# EAGLE design Bordnetzwandler (EAGLE 6.6.0)

## Sheet 1 of 4: Supply
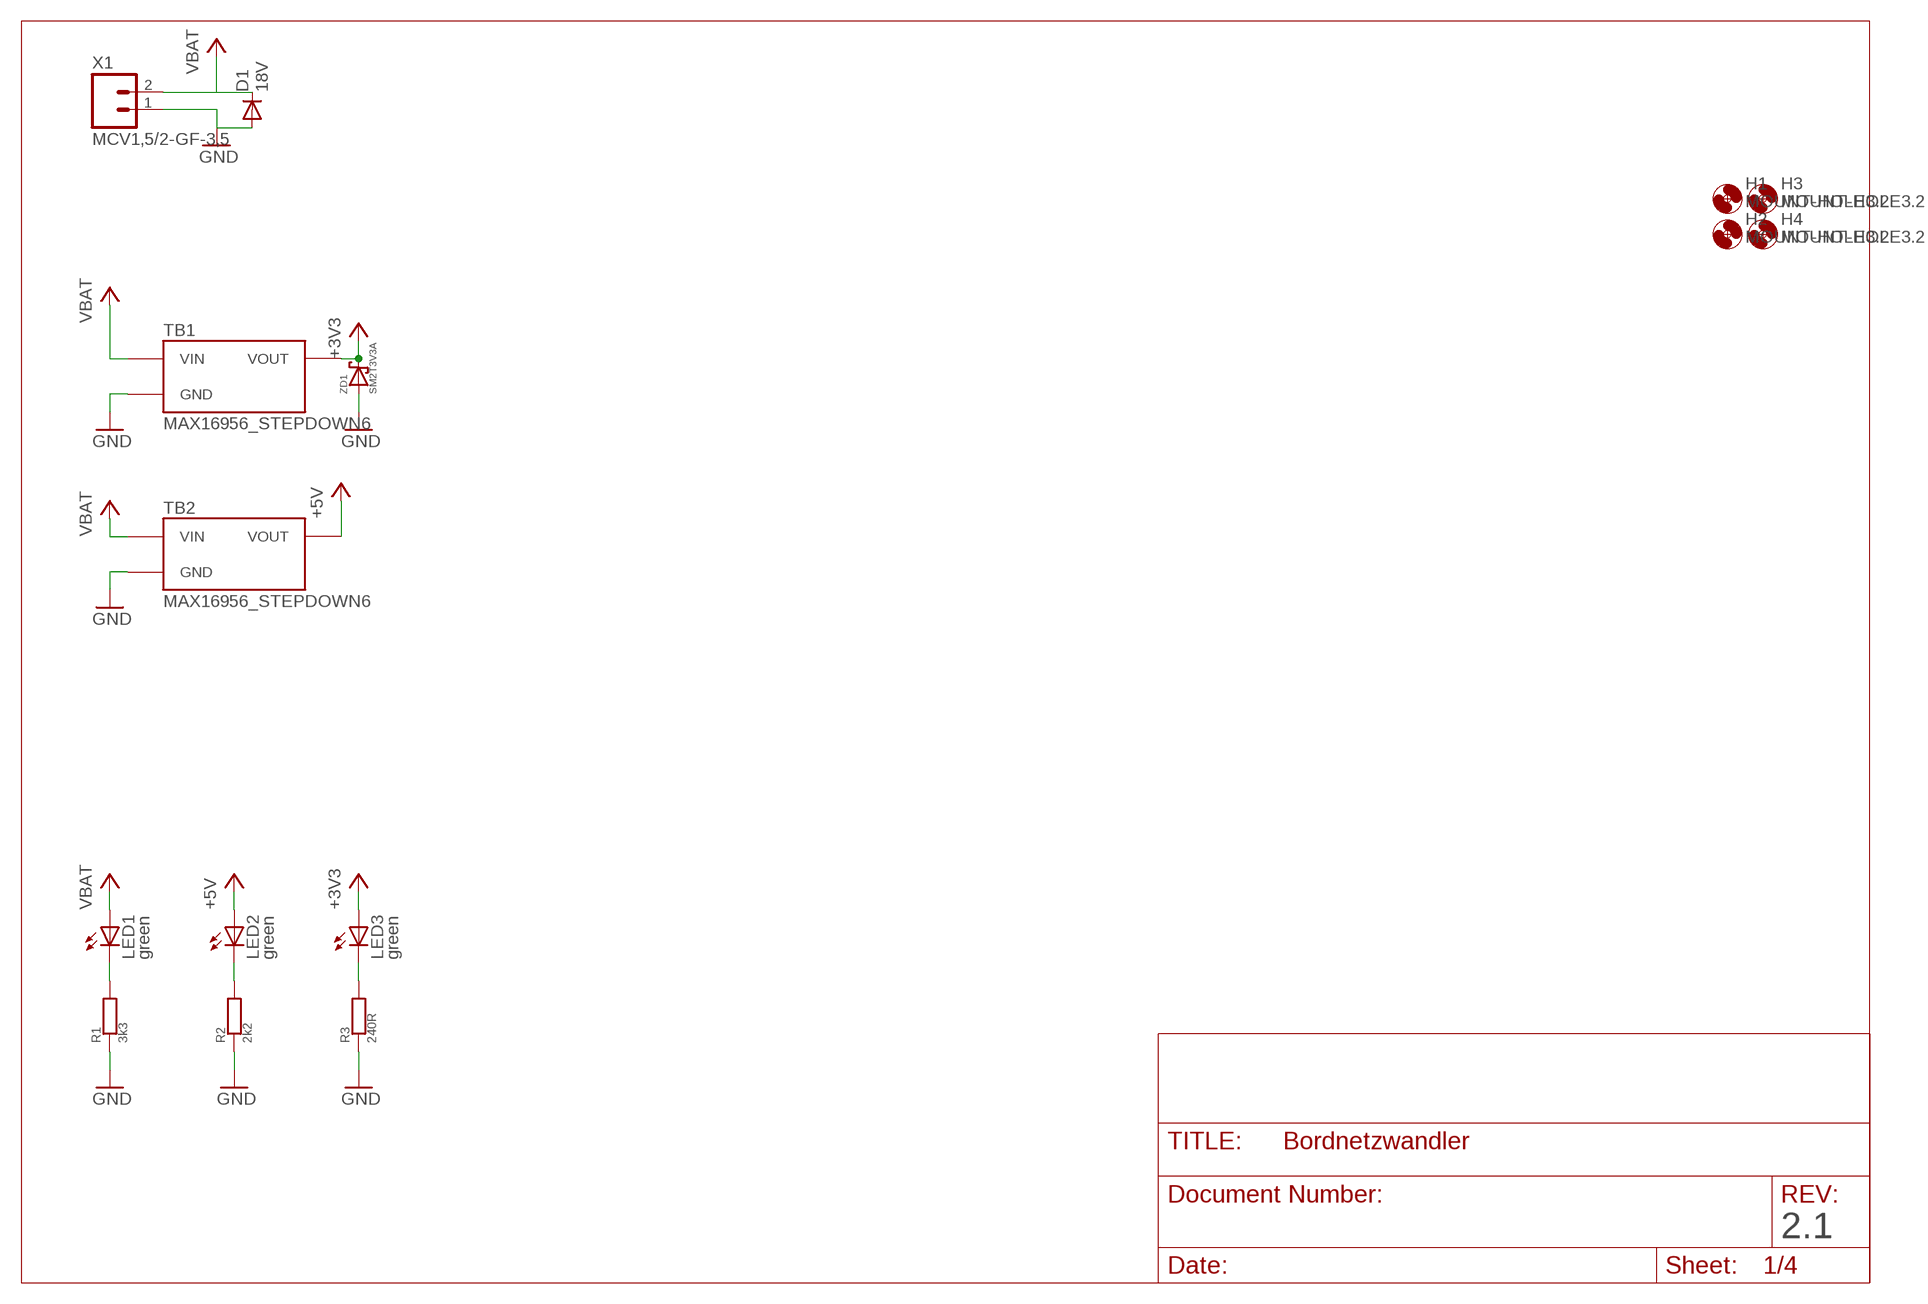
[diagram p0: schematic, sheet 1]

### Parts
D1  18V  DIODE-DO214AA  [DO214AA]
H1  MOUNT-HOLE3.2  [3,2]
H2  MOUNT-HOLE3.2  [3,2]
H3  MOUNT-HOLE3.2  [3,2]
H4  MOUNT-HOLE3.2  [3,2]
LED1  green  LEDCHIP-LED0805  [CHIP-LED0805]
LED2  green  LEDCHIP-LED0805  [CHIP-LED0805]
LED3  green  LEDCHIP-LED0805  [CHIP-LED0805]
R1  3k3  R  [R0805]
R2  2k2  R  [R0805]
R3  240R  R  [R0805]
TB1  MAX16956_STEPDOWN6  [MAX16956_STEPDOWN6]
TB2  MAX16956_STEPDOWN6  [MAX16956_STEPDOWN6]
X1  MCV1,5/2-GF-3,5  [MCV1,5/2-GF-3,5]
ZD1  SM2T3V3A  [SM2T3V3A]

### Nets
+3V3: LED3.A TB1.VOUT ZD1.P$2 ; also sheet 2,4
+5V: LED2.A TB2.VOUT ; also sheet 2,3
GND: D1.A R1.1 R2.1 R3.1 TB1.GND TB1.GND2(GND) TB2.GND TB2.GND2(GND) X1.1 ZD1.P$1 ZD1.P$11 ; also sheet 2,3,4
N$1: LED2.C R2.2
N$2: LED3.C R3.2
N$5: LED1.C R1.2
VBAT: D1.C LED1.A TB1.VIN TB2.VIN X1.2 ; also sheet 2,3,4

### Notes on the sheet
- 2.1

## Sheet 2 of 4: Prozessor
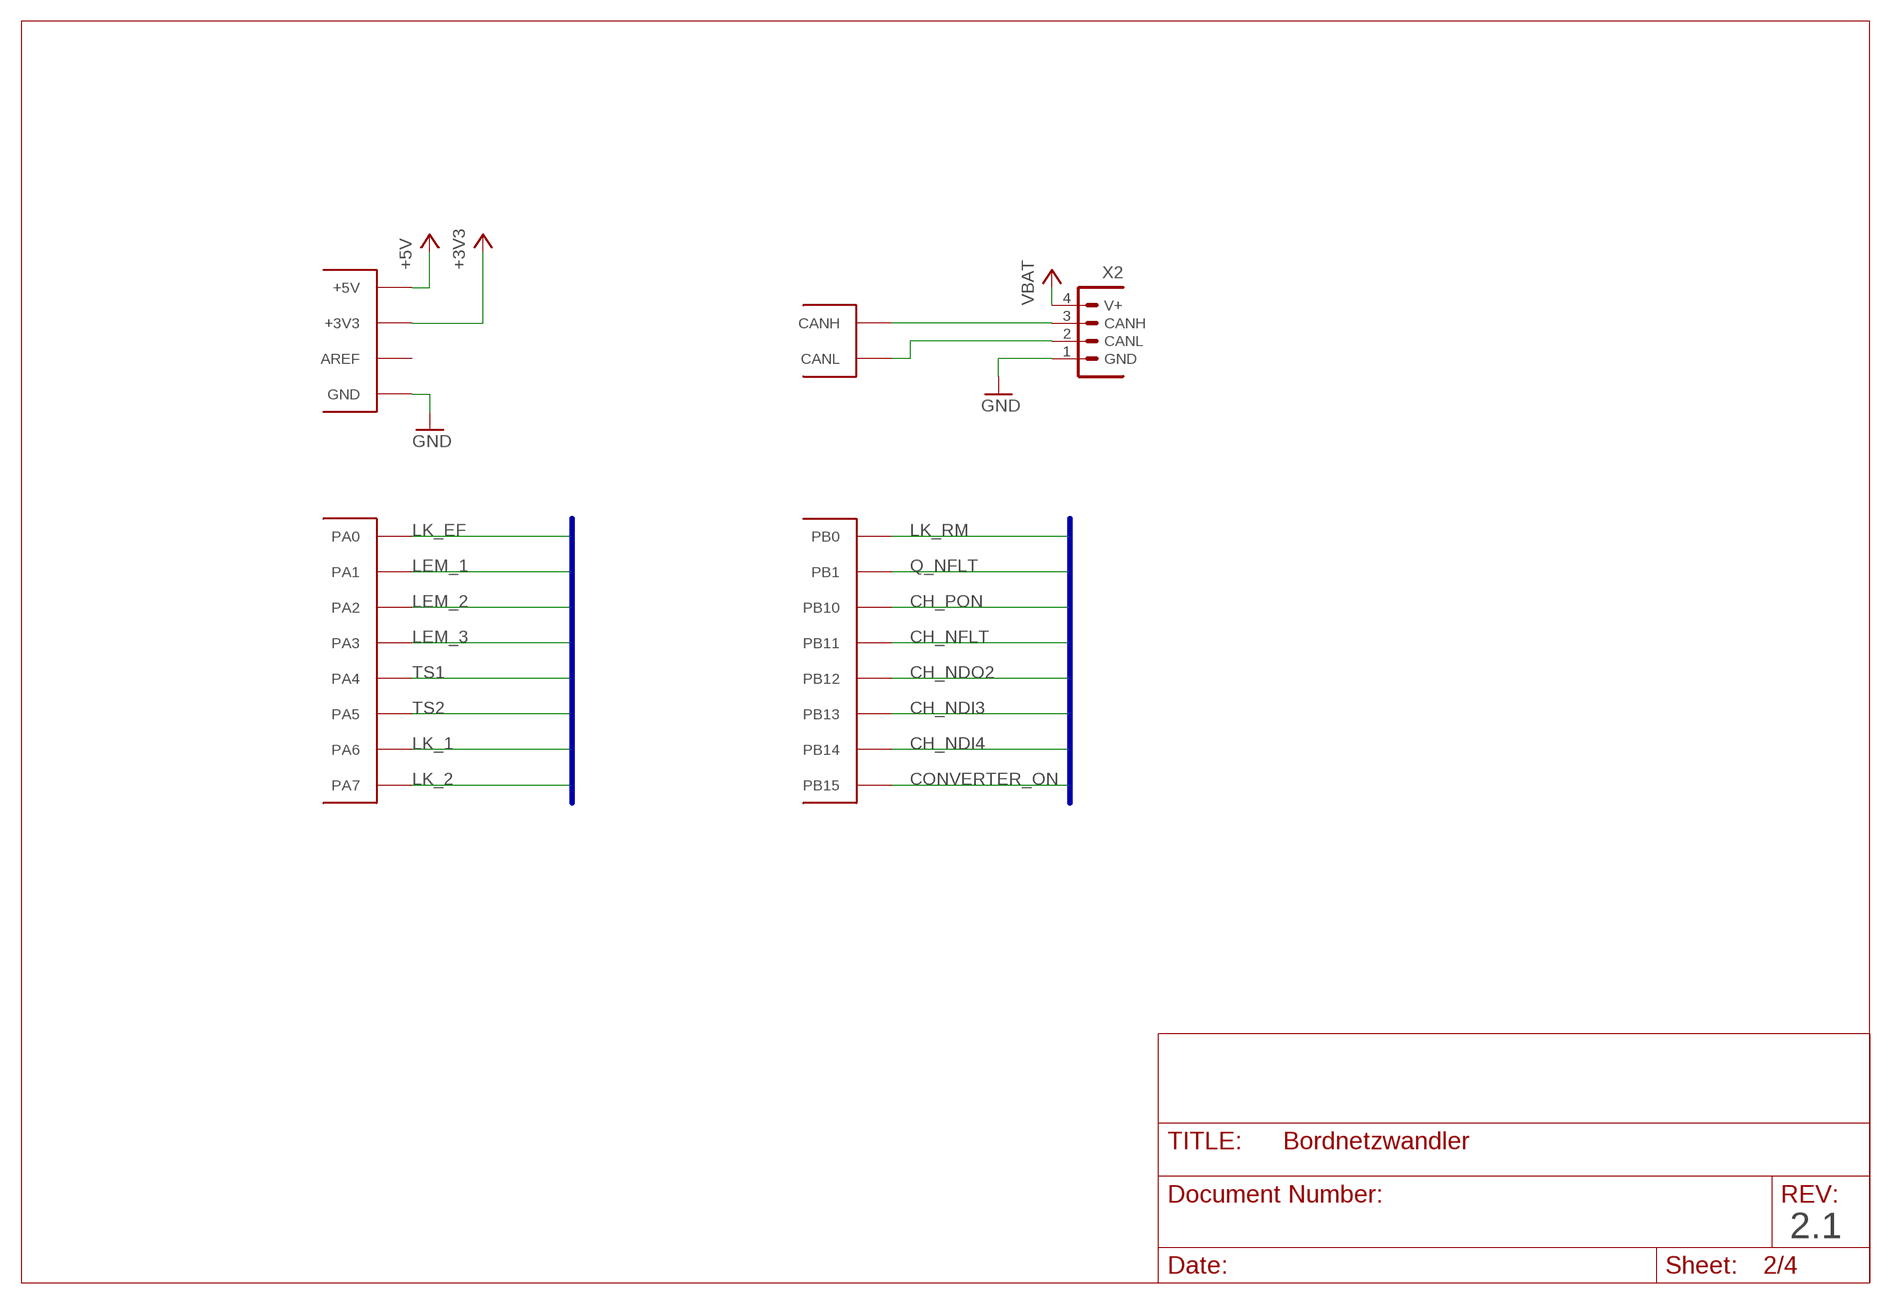
[diagram p1: schematic, sheet 2]

### Parts
CANIO_1  STM32F103XX_CAN-IO-EXPANDER  [STM32F103XX_CANIO-EXPANDER]
X2  CIOC_4-1-FV-A_CAN-BELEGUNG  [CIOC_4-1-FV]

### Nets
+3V3: CANIO_1.VCC(+3V3) ; also sheet 1,4
+5V: CANIO_1.+5V ; also sheet 1,3
CAN1_H: CANIO_1.CANH X2.3(CANH)
CAN1_L: CANIO_1.CANL X2.2(CANL)
CH_NDI3: CANIO_1.PB13 ; also sheet 4
CH_NDI4: CANIO_1.PB14 ; also sheet 4
CH_NDO2: CANIO_1.PB12 ; also sheet 4
CH_NFLT: CANIO_1.PB11 ; also sheet 4
CH_PON: CANIO_1.PB10 ; also sheet 4
CONVERTER_ON: CANIO_1.PB15 ; also sheet 4
GND: CANIO_1.GND1(GND) X2.1(GND) ; also sheet 1,3,4
LEM_1: CANIO_1.PA1 ; also sheet 3
LEM_2: CANIO_1.PA2 ; also sheet 3
LEM_3: CANIO_1.PA3 ; also sheet 3
LK_1: CANIO_1.PA6 ; also sheet 4
LK_2: CANIO_1.PA7 ; also sheet 4
LK_EF: CANIO_1.PA0 ; also sheet 4
LK_RM: CANIO_1.PB0 ; also sheet 4
Q_NFLT: CANIO_1.PB1 ; also sheet 4
TS1: CANIO_1.PA4 ; also sheet 3
TS2: CANIO_1.PA5 ; also sheet 3
VBAT: X2.4(V+) ; also sheet 1,3,4
Unconnected: CANIO_1.AREF

### Buses
PA[0..7]
PB[10..15],PB[0..1]

### Notes on the sheet
- 2.1

## Sheet 3 of 4: IO
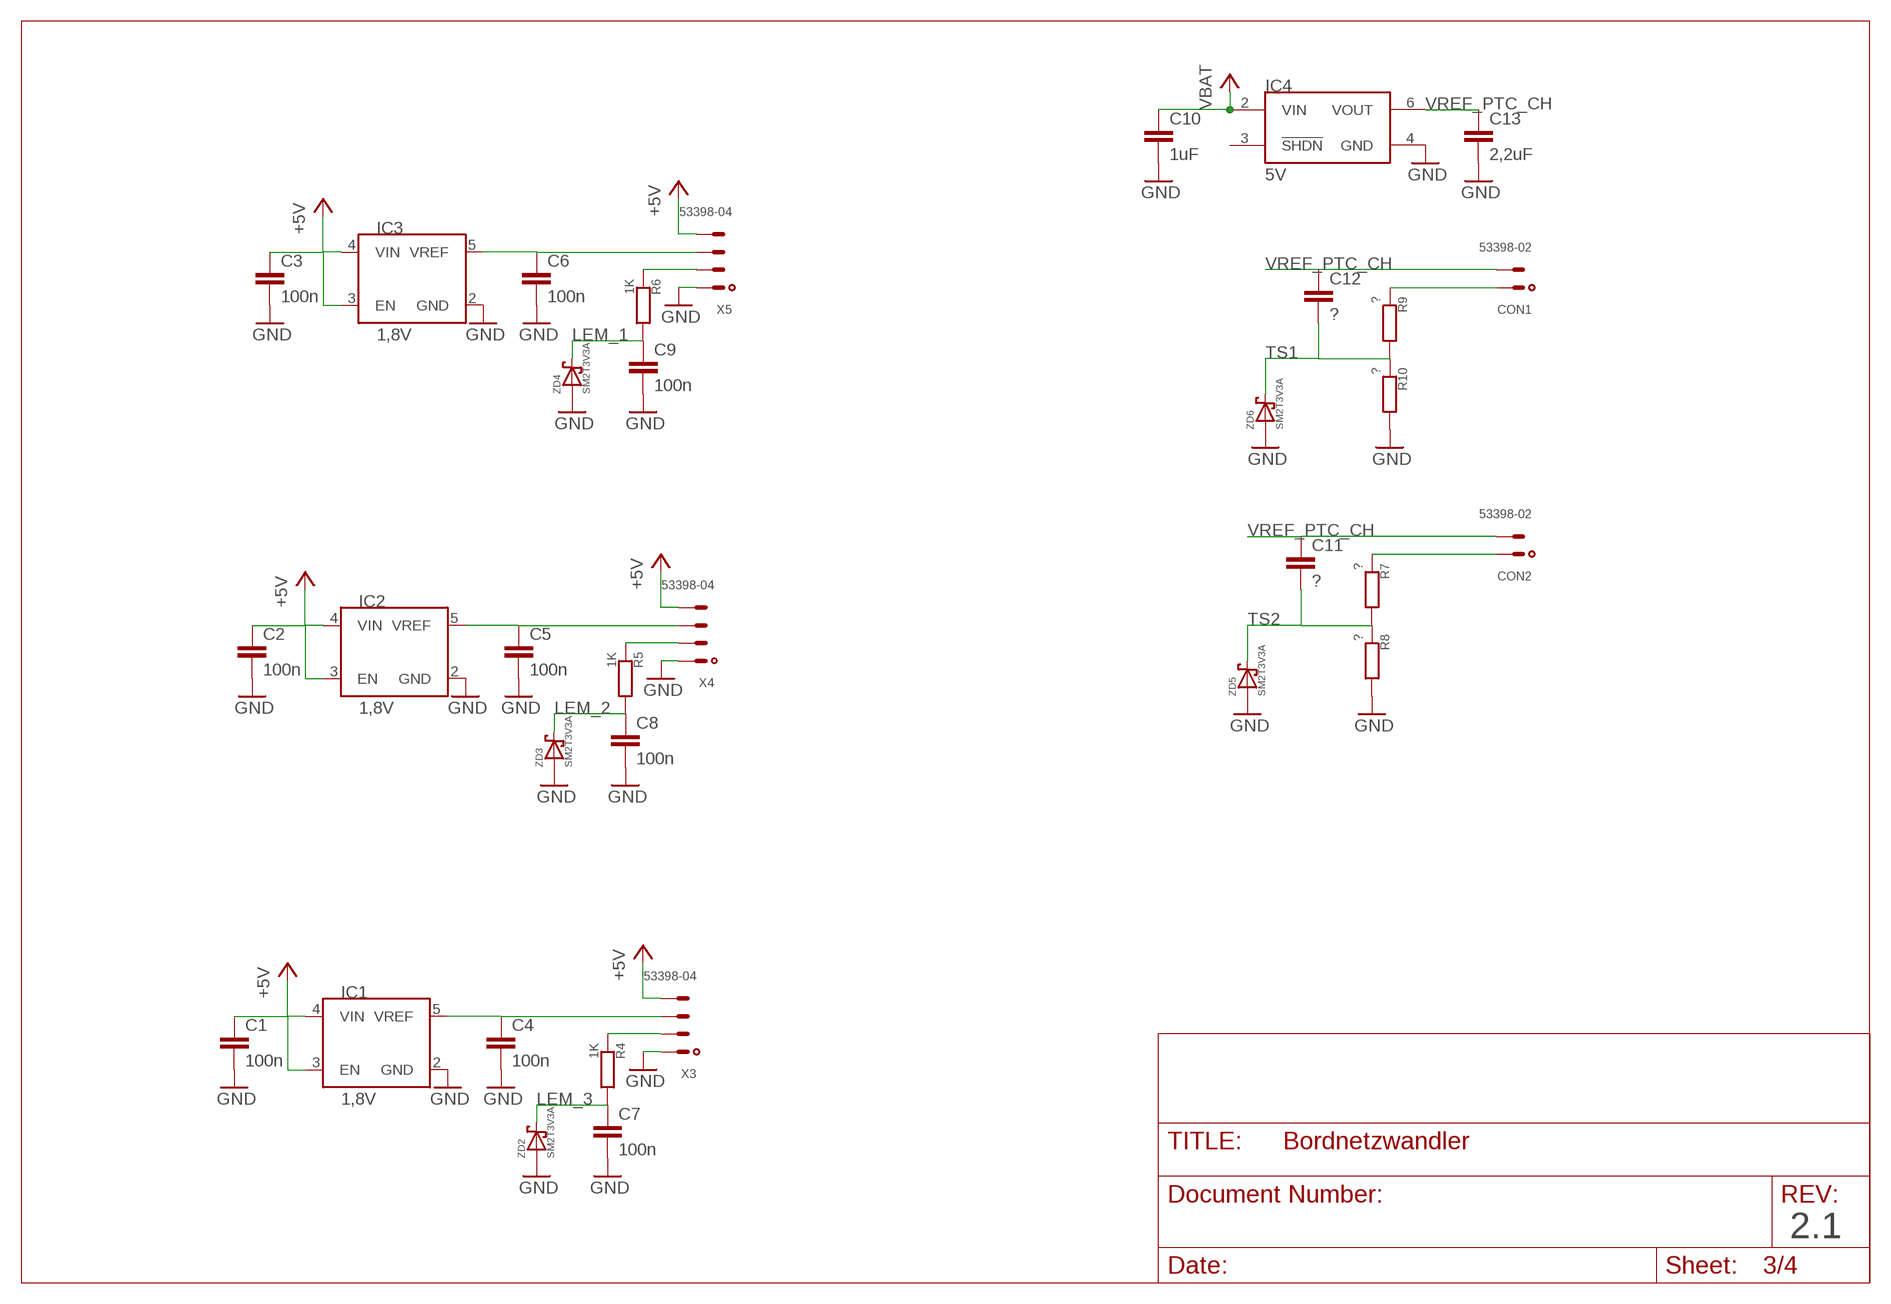
[diagram p2: schematic, sheet 3]

### Parts
C1  100n  C-EUC0805  [C0805]
C2  100n  C-EUC0805  [C0805]
C3  100n  C-EUC0805  [C0805]
C4  100n  C-EUC0805  [C0805]
C5  100n  C-EUC0805  [C0805]
C6  100n  C-EUC0805  [C0805]
C7  100n  C-EUC0805  [C0805]
C8  100n  C-EUC0805  [C0805]
C9  100n  C-EUC0805  [C0805]
C10  1uF  C-EUC0805  [C0805]
C11  ?  C-EUC0805  [C0805]
C12  ?  C-EUC0805  [C0805]
C13  2,2uF  C-EUC0805  [C0805]
CON1  53398-02  [53398-02]
CON2  53398-02  [53398-02]
IC1  1,8V  LM4132L  [SOT23-5L]
IC2  1,8V  LM4132L  [SOT23-5L]
IC3  1,8V  LM4132L  [SOT23-5L]
IC4  5V  LT1461  [SO08]
R4  1K  R  [R0805]
R5  1K  R  [R0805]
R6  1K  R  [R0805]
R7  ?  R  [R0805]
R8  ?  R  [R0805]
R9  ?  R  [R0805]
R10  ?  R  [R0805]
X3  53398-04  [53398-04]
X4  53398-04  [53398-04]
X5  53398-04  [53398-04]
ZD2  SM2T3V3A  [SM2T3V3A]
ZD3  SM2T3V3A  [SM2T3V3A]
ZD4  SM2T3V3A  [SM2T3V3A]
ZD5  SM2T3V3A  [SM2T3V3A]
ZD6  SM2T3V3A  [SM2T3V3A]

### Nets
+5V: C1.1 C2.1 C3.1 IC1.3(EN) IC1.4(VIN) IC2.3(EN) IC2.4(VIN) IC3.3(EN) IC3.4(VIN) X3.4 X4.4 X5.4 ; also sheet 1,2
GND: C1.2 C2.2 C3.2 C4.2 C5.2 C6.2 C7.2 C8.2 C9.2 C10.2 C13.2 IC1.2(GND) IC2.2(GND) IC3.2(GND) IC4.4(GND) R8.2 R10.2 X3.1 X4.1 X5.1 ZD2.P$1 ZD2.P$11 ZD3.P$1 ZD3.P$11 ZD4.P$1 ZD4.P$11 ZD5.P$1 ZD5.P$11 ZD6.P$1 ZD6.P$11 ; also sheet 1,2,4
LEM_1: C9.1 R6.2 ZD4.P$2 ; also sheet 2
LEM_2: C8.1 R5.2 ZD3.P$2 ; also sheet 2
LEM_3: C7.1 R4.2 ZD2.P$2 ; also sheet 2
N$4: C4.1 IC1.5(VREF) X3.3
N$7: R6.1 X5.2
N$9: C5.1 IC2.5(VREF) X4.3
N$25: CON1.1 R9.1
N$31: R5.1 X4.2
N$32: C6.1 IC3.5(VREF) X5.3
N$33: R4.1 X3.2
N$35: CON2.1 R7.1
TS1: C12.2 R9.2 R10.1 ZD6.P$2 ; also sheet 2
TS2: C11.2 R7.2 R8.1 ZD5.P$2 ; also sheet 2
VBAT: C10.1 IC4.2(VIN) ; also sheet 1,2,4
VREF_PTC_CH: C11.1 C12.1 C13.1 CON1.2 CON2.2 IC4.6(VOUT)
Unconnected: IC4.3(!SHDN)

### Notes on the sheet
- 2.1

## Sheet 4 of 4: Laderegler und Ladestecker
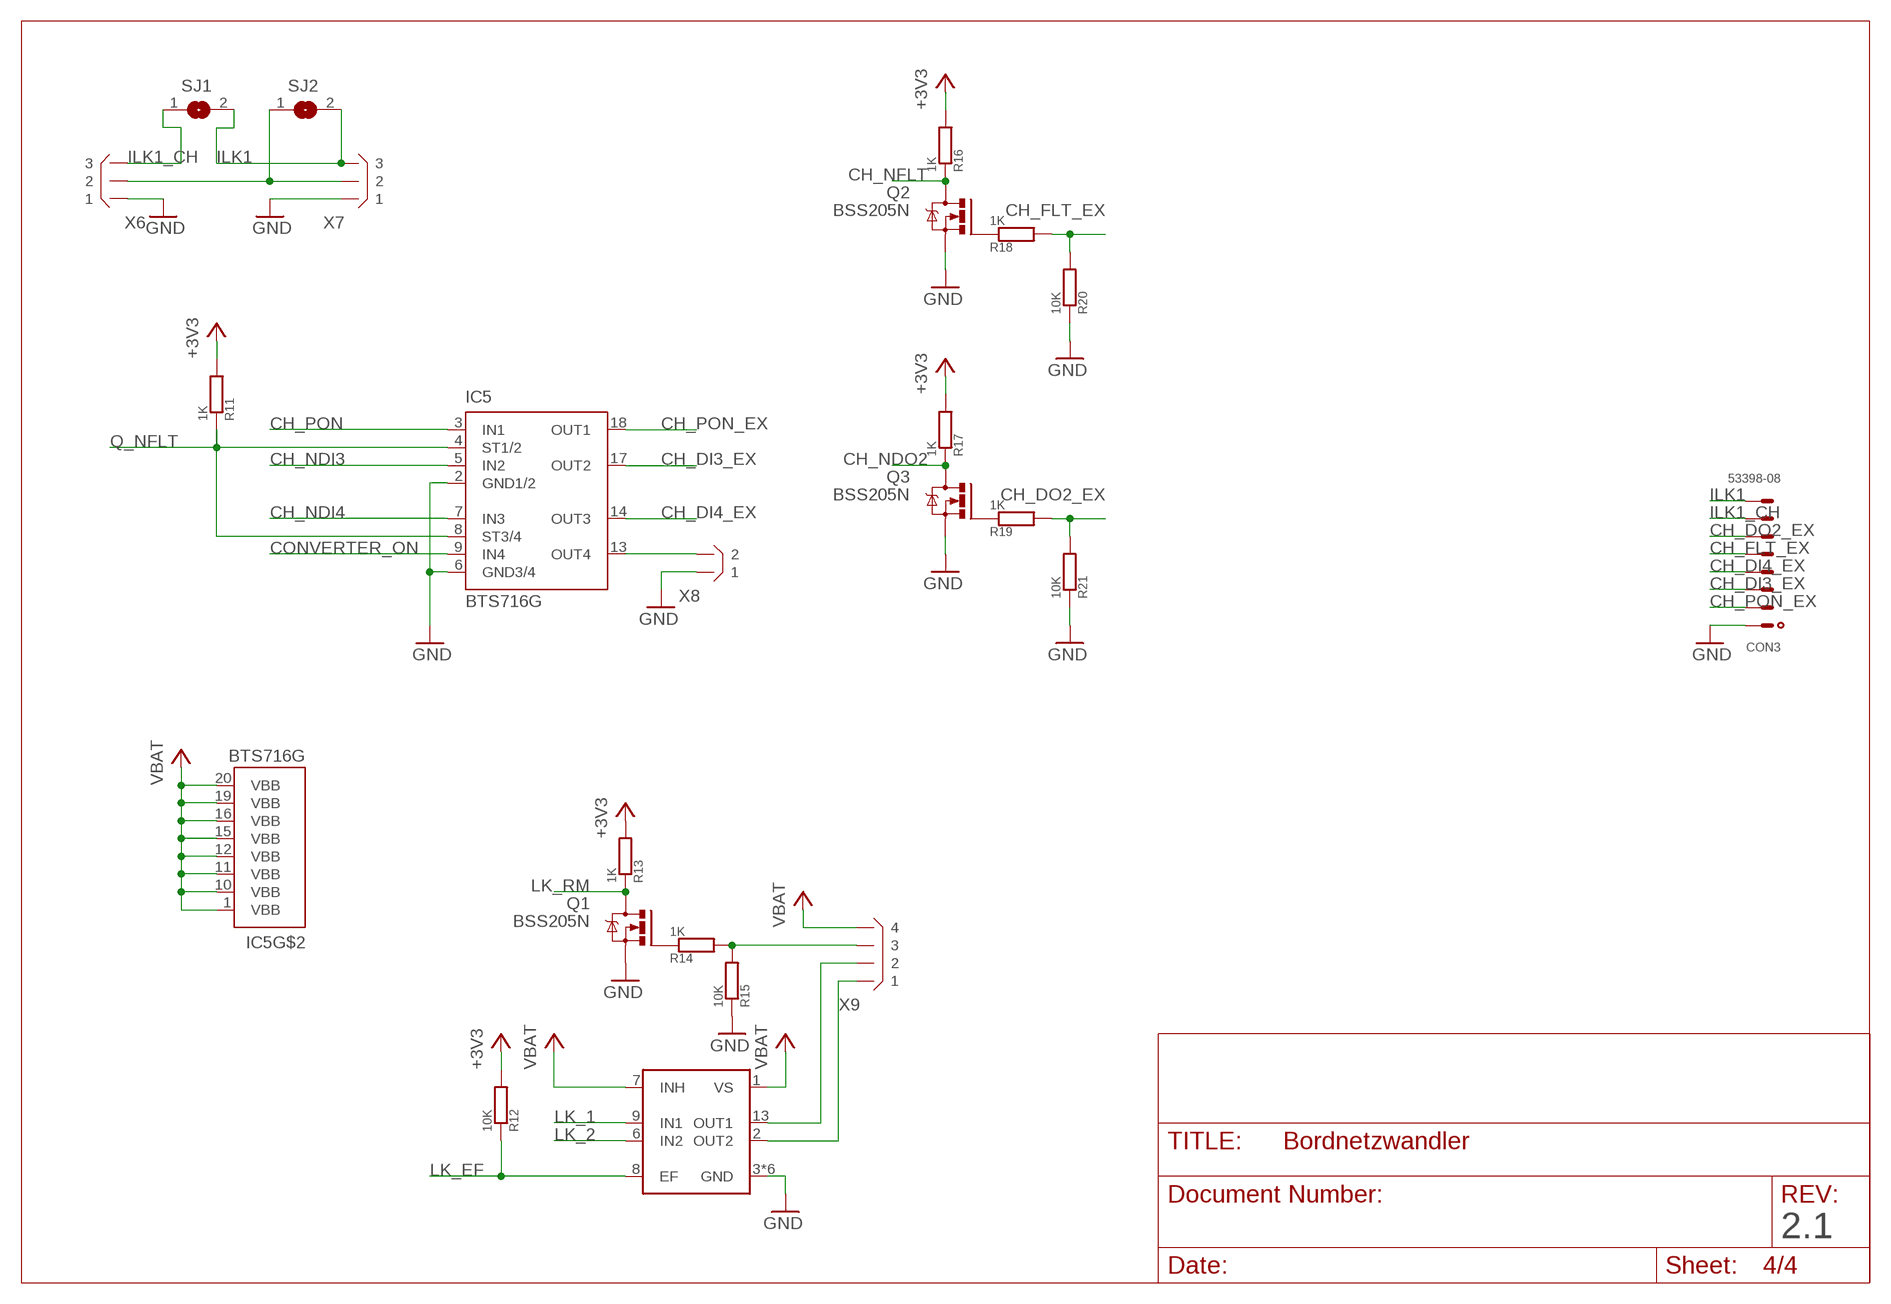
[diagram p3: schematic, sheet 4]

### Parts
CON3  53398-08  [53398-08]
IC5  BTS716G  [PG-DSO-20]
IC6  TLE4207GN  [INF-PG-DSO-14-22_N_1PRIMARY]
Q1  BSS205N  [SOT23]
Q2  BSS205N  [SOT23]
Q3  BSS205N  [SOT23]
R11  1K  R0603  [R0603]
R12  10K  R  [R0805]
R13  1K  R  [R0805]
R14  1K  R  [R0805]
R15  10K  R  [R0805]
R16  1K  R0603  [R0603]
R17  1K  R0603  [R0603]
R18  1K  R0603  [R0603]
R19  1K  R0603  [R0603]
R20  10K  R0603  [R0603]
R21  10K  R0603  [R0603]
SJ1  SJ  [SJ]
SJ2  SJ  [SJ]
X6  B3B-XH  [B3B-XH]
X7  B3B-XH  [B3B-XH]
X8  B2B-XH  [B2B-XH]
X9  B4B-XH  [B4B-XH]

### Nets
+3V3: R11.2 R12.2 R13.2 R16.2 R17.2 ; also sheet 1,2
CH_DI3_EX: CON3.3 IC5.17(OUT2)
CH_DI4_EX: CON3.4 IC5.14(OUT3)
CH_DO2_EX: CON3.6 R19.2 R21.2
CH_FLT_EX: CON3.5 R18.2 R20.2
CH_NDI3: IC5.5(IN2) ; also sheet 2
CH_NDI4: IC5.7(IN3) ; also sheet 2
CH_NDO2: Q3.3(D) R17.1 ; also sheet 2
CH_NFLT: Q2.3(D) R16.1 ; also sheet 2
CH_PON: IC5.3(IN1) ; also sheet 2
CH_PON_EX: CON3.2 IC5.18(OUT1)
CONVERTER_ON: IC5.9(IN4) ; also sheet 2
GND: CON3.1 IC5.2(GND1/2) IC5.6(GND3/4) IC6.3(GND) IC6.4(GND) IC6.5(GND) IC6.10(GND) IC6.11(GND) IC6.12(GND) Q1.2(S) Q2.2(S) Q3.2(S) R15.1 R20.1 R21.1 X6.P$1 X7.P$1 X8.P$1 ; also sheet 1,2,3
ILK1: CON3.8 SJ1.2 SJ2.2 X7.P$3
ILK1_CH: CON3.7 SJ1.1 X6.P$3
ILK2: SJ2.1 X6.P$2 X7.P$2
LK_1: IC6.9(IN1) ; also sheet 2
LK_2: IC6.6(IN2) ; also sheet 2
LK_EF: IC6.8(EF) R12.1 ; also sheet 2
LK_RM: Q1.3(D) R13.1 ; also sheet 2
N$3: IC5.13(OUT4) X8.P$2
N$16: Q3.1(G) R19.1
N$38: Q1.1(G) R14.1
N$39: R14.2 R15.2 X9.P$3
N$41: IC6.13(OUT1) X9.P$2
N$42: IC6.2(OUT2) X9.P$1
N$45: Q2.1(G) R18.1
Q_NFLT: IC5.4(ST1/2) IC5.8(ST3/4) R11.1 ; also sheet 2
VBAT: IC5.1(VBB) IC5.10(VBB) IC5.11(VBB) IC5.12(VBB) IC5.15(VBB) IC5.16(VBB) IC5.19(VBB) IC5.20(VBB) IC6.1(VS) IC6.7(INH) X9.P$4 ; also sheet 1,2,3

### Notes on the sheet
- 2.1

## Library data of the parts
C1-C13 = rcl:C-EU: CAPACITOR, European symbol
CANIO_1 = tera-boards:STM32F103XX_CAN-IO-EXPANDER: Tera CAN-IO Expander Board
CON1 CON2 = con-molex:53?-02: CONNECTOR wire to board 1.25 mm (.049 inch) pitch header
CON3 = con-molex:53?-08: CONNECTOR wire to board 1.25 mm (.049 inch) pitch header
D1 = diode:DIODE-: DIODE
H1-H4 = holes:MOUNT-HOLE: MOUNTING HOLE with drill center marker
IC1-IC3 = ti:LM4132
IC4 = linear:LT1461
IC5 = infineon:BTS716G: Smart High-Side Power Switch Four Channels: 4 x 140mOhm staus Feedback Source: http://www.infineon.com/dgdl/BTS716G.pdf; OC_FARNELL: unknown; OC_NEWARK: unknown
IC6 = infineon:TLE4207G
LED1-LED3 = led:LED: LED OSRAM: - CHIPLED LG R971, LG N971, LY N971, LG Q971, LY Q971, LO R971, LY R971 LH N974, LH R974 LS Q976, LO Q976, LY Q976 LO Q996 - Hyper CHIPLED LW Q18S LB Q993, LB Q99A, LB R99A - SideLED LS A670, LO A670, LY A670, LG A670, LP A670 LB A673, LV A673, LT A673, LW A673 LH A674 LY A675 LS A676, LA A676, LO A676, LY A676, LW A676 LS A679, LY A679, LG A679 - Hyper Micro SIDELED® LS Y876, LA Y876, LO Y876, LY Y876 LT Y87S - SmartLED LW L88C, LW L88S LB L89C, LB L89S, LG L890 LS L89K, LO L89K, LY L89K LS L896, LA L896, LO L896, LY L896 - TOPLED LS T670, LO T670, LY T670, LG T670, LP T670 LSG T670, LSP T670, LSY T670, LOP T670, LYG T670 LG T671, LOG T671, LSG T671 LB T673, LV T673, LT T673, LW T673 LH T674 LS T676, LA T676, LO T676, LY T676, LB T676, LH T676, LSB T676, LW T676 LB T67C, LV T67C, LT T67C, LS T67K, LO T67K, LY T67K, LW E67C LS E67B, LA E67B, LO E67B, LY E67B, LB E67C, LV E67C, LT E67C LW T67C LS T679, LY T679, LG T679 LS T770, LO T770, LY T770, LG T770, LP T770 LB T773, LV T773, LT T773, LW T773 LH T774 LS E675, LA E675, LY E675, LS T675 LS T776, LA T776, LO T776, LY T776, LB T776 LHGB T686 LT T68C, LB T68C - Hyper Mini TOPLED® LB M676 - Mini TOPLED Santana® LG M470 LS M47K, LO M47K, LY M47K Source: http://www.osram.convergy.de LUXEON: - LUMILED® LXK2-PW12-R00, LXK2-PW12-S00, LXK2-PW14-U00, LXK2-PW14-V00 LXK2-PM12-R00, LXK2-PM12-S00, LXK2-PM14-U00 LXK2-PE12-Q00, LXK2-PE12-R00, LXK2-PE12-S00, LXK2-PE14-T00, LXK2-PE14-U00 LXK2-PB12-K00, LXK2-PB12-L00, LXK2-PB12-M00, LXK2-PB14-N00, LXK2-PB14-P00, LXK2-PB14-Q00 LXK2-PR12-L00, LXK2-PR12-M00, LXK2-PR14-Q00, LXK2-PR14-R00 LXK2-PD12-Q00, LXK2-PD12-R00, LXK2-PD12-S00 LXK2-PH12-R00, LXK2-PH12-S00 LXK2-PL12-P00, LXK2-PL12-Q00, LXK2-PL12-R00 Source: www.luxeon.com KINGBRIGHT: KA-3528ASYC Source: www.kingbright.com
Q1-Q3 = infineon:BSS205N: Infineon Small Signal Transistor, OptiMOS 2 Technology, 20V, 2.5A SOT23
R1-R21 = useful:R
SJ1 SJ2 = jumper:SJ: SMD solder JUMPER
TB1 TB2 = tera-boards:MAX16956_STEPDOWN6
X1 = con-phoenix:MCV1,5/2-GF-3,5
X2 = con-phoenix:CIOC_4-1-FV-A_CAN-BELEGUNG: CIOC_4-1-FV-A mit Bezeichnungen für CAN-Signale und Versorgungen; MANUF: Phoenix-Contact; ORDERNR: 1701388
X3-X5 = con-molex:53?-04: CONNECTOR wire to board 1.25 mm (.049 inch) pitch header
X6 X7 = con-jst-xh:?3B-XH
X8 = con-jst-xh:?2B-XH
X9 = con-jst-xh:?4B-XH
ZD1-ZD6 = st:SM2T3V3A: ST2T3V3A Low voltage TransilTM

## Board
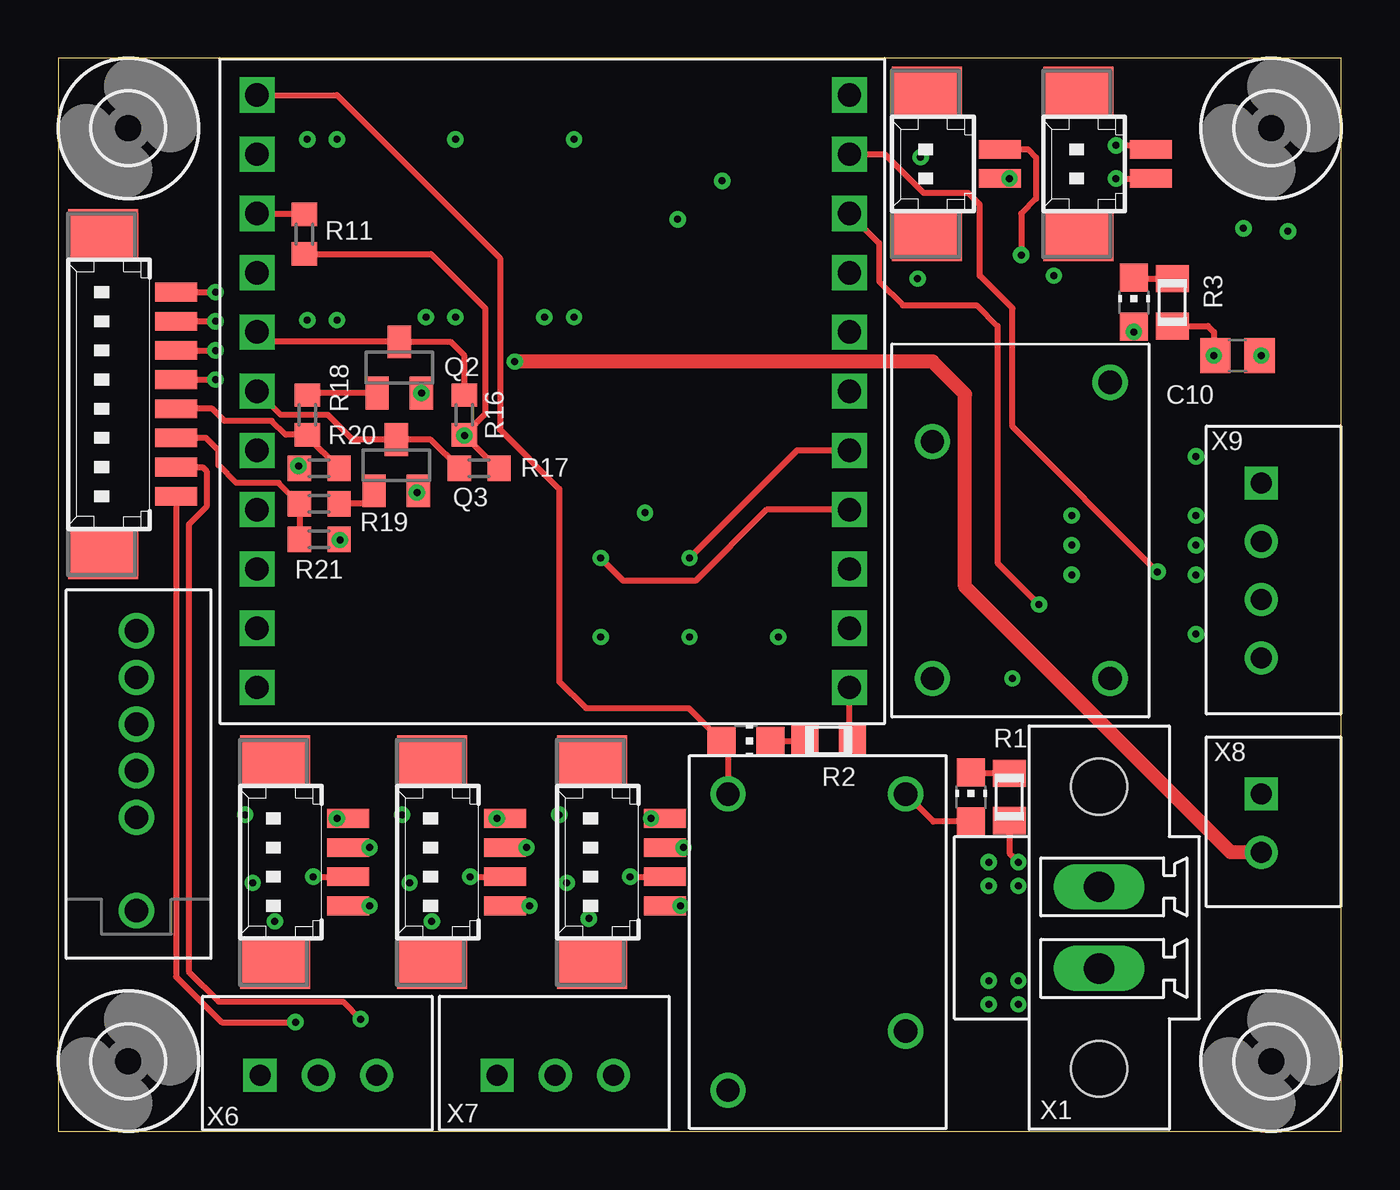
[diagram p4: board, top side]
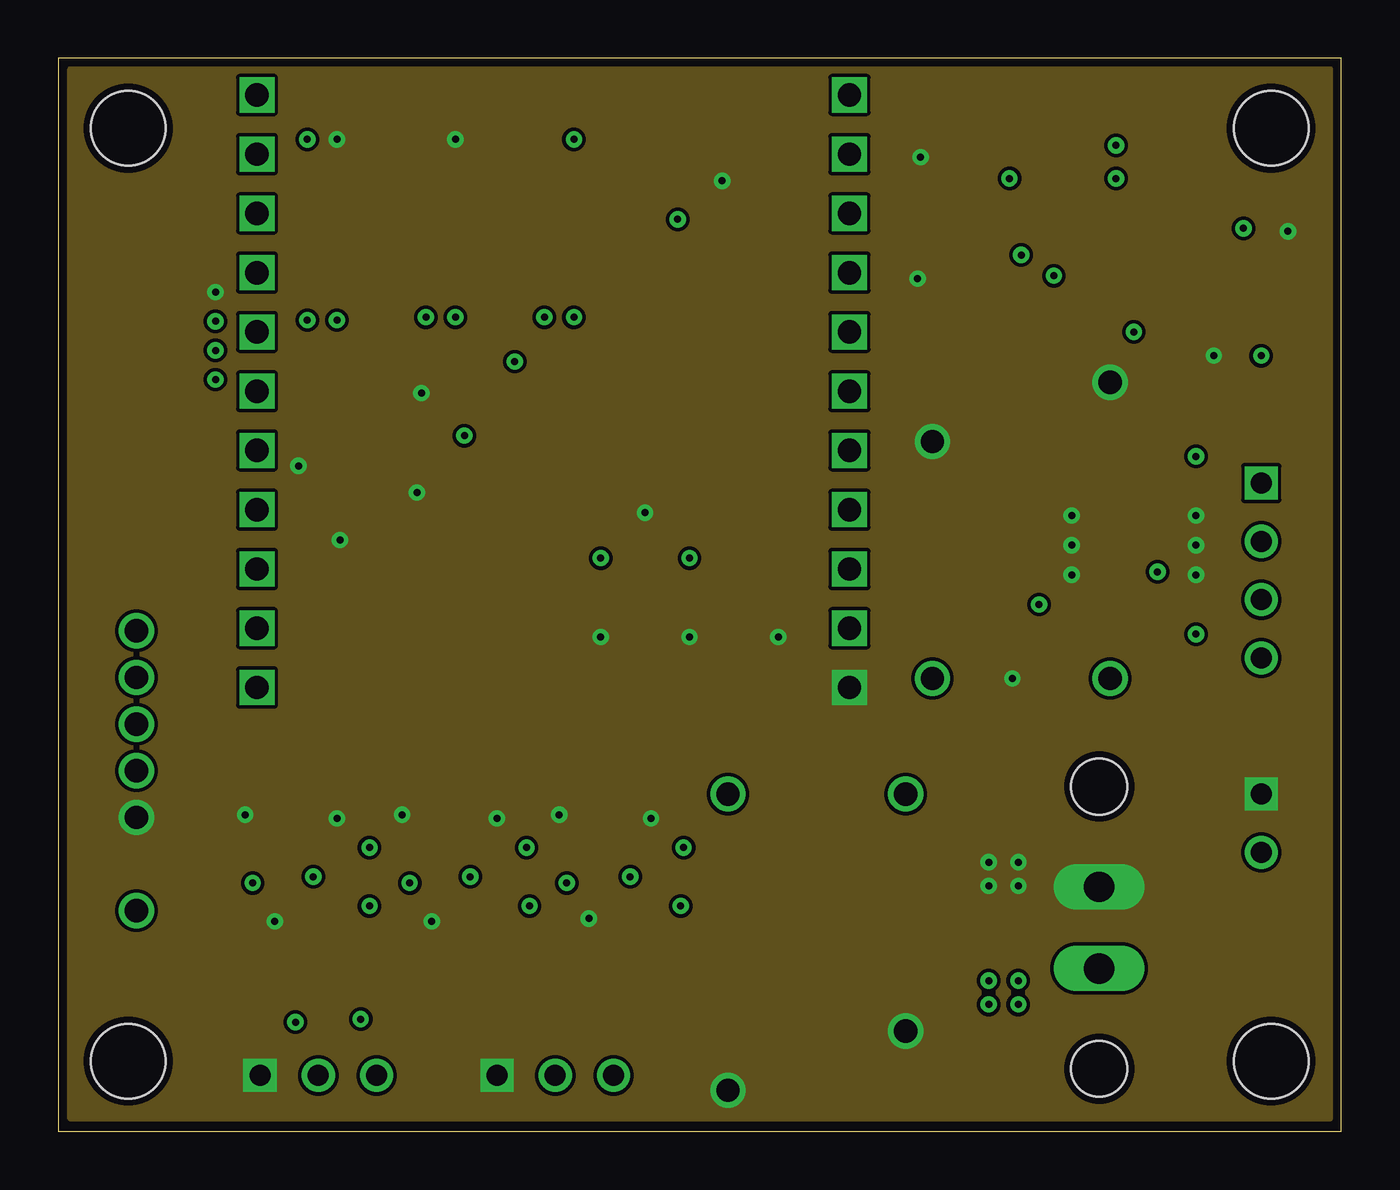
[diagram p5: board, inner layer Route2]
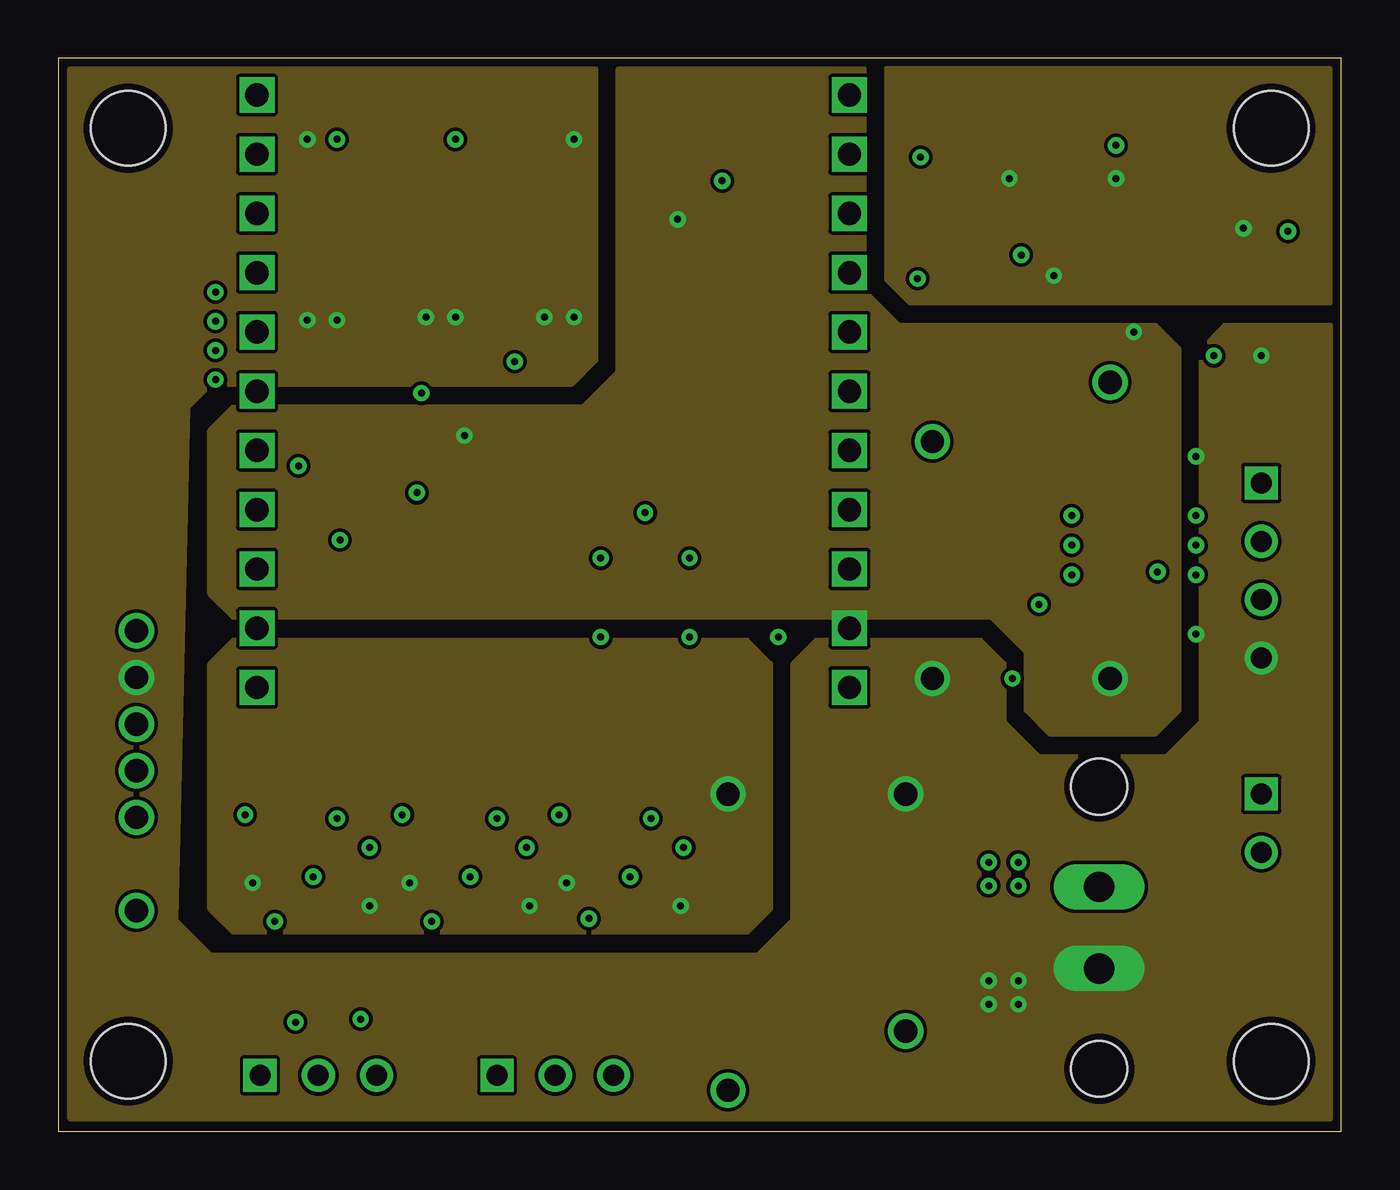
[diagram p6: board, inner layer Route15]
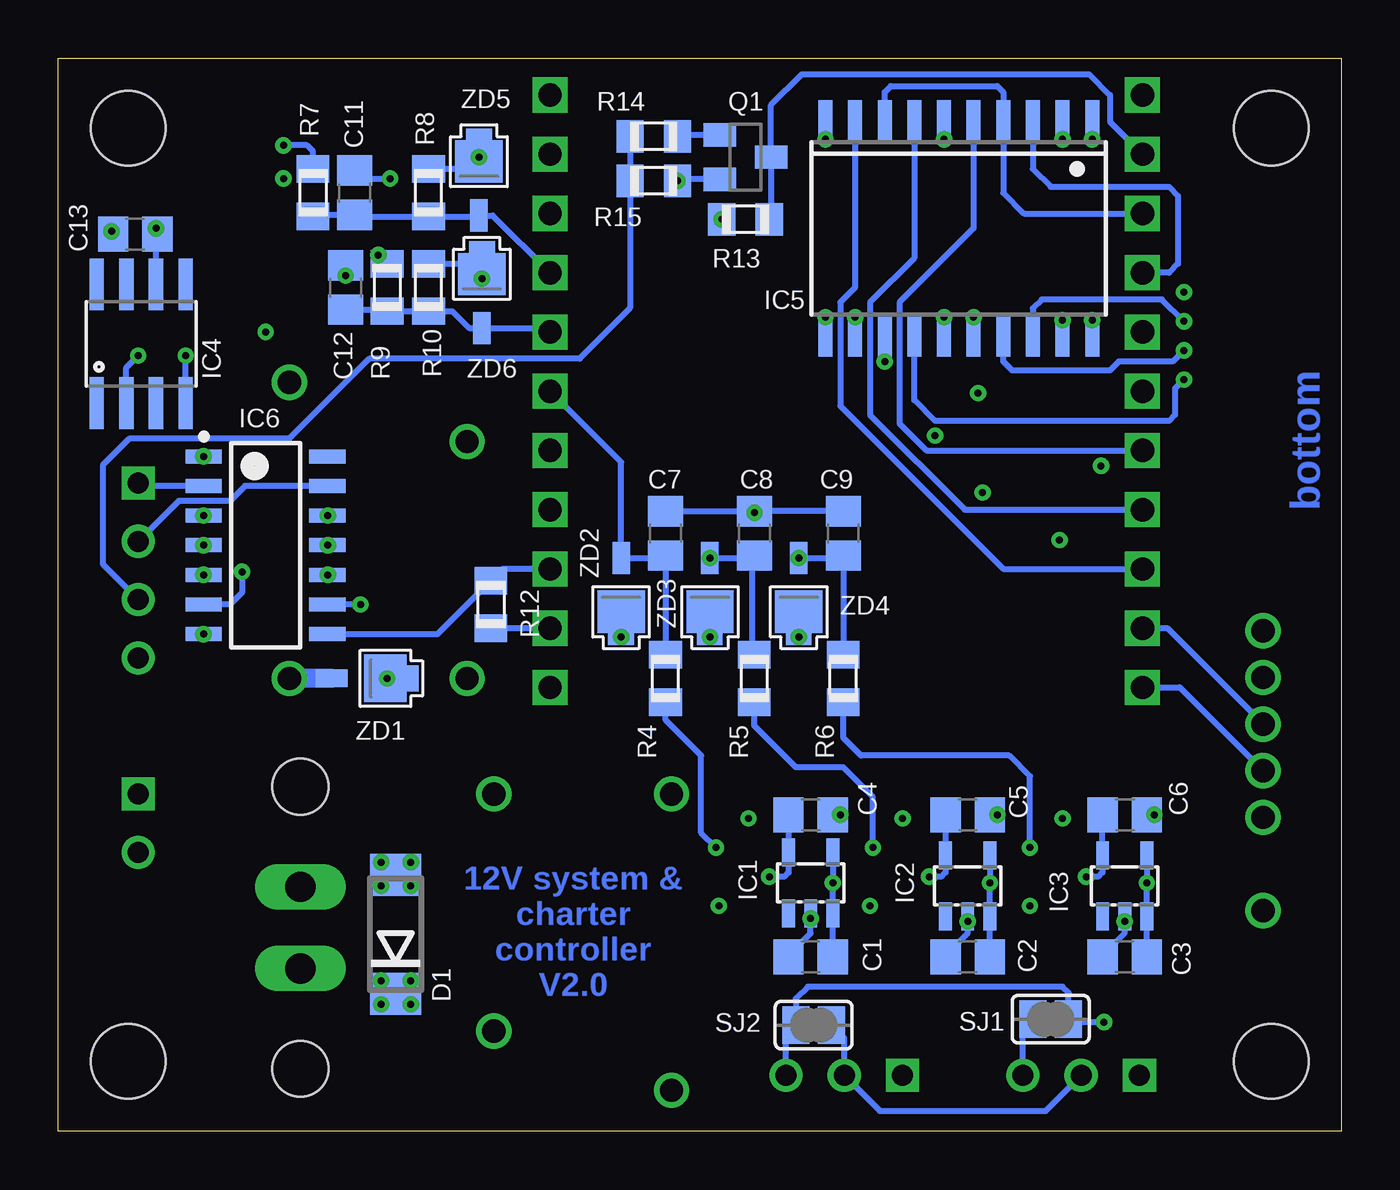
[diagram p7: board, bottom side, seen from below]

Size 55 x 46 mm. Coordinates in mm from the lower left corner, seen from the top.
Outline: 0,0 55,0 55,46 0,46 0,0
Copper layers (1+2*15+16): Top 0.035mm / dielectric 0.2mm / Route2 0.035mm / dielectric 0.5mm / Route15 0.035mm / dielectric 0.2mm / Bottom 0.035mm
Design rules "ats_35u_4layer *": minimum track width 6mil, minimum drill 0.2mm, track to track 6mil, track to pad 6mil, pad to pad 6mil, via to via 6mil, smd to smd 6mil, copper to edge 0.3mm, drill to drill 8mil, minimum pad ring 10mil, minimum via ring 0.2mm, stop-mask expansion 4mil, vias tented up to drill 0mil, thermal gap 10mil

### Footprints (pad centres in the part's own frame; a part is rotated, then mirrored left to right if it is on the bottom)
C0805 = smd 1.3 x 1.5: 1 -0.95,0; 2 0.95,0
STM32F103XX_CANIO-EXPANDER = drill 1 square: +5V 0,0; AREF 25.4,0; CANH 0,-22.86; CANL 0,-25.4; GND1 25.4,-25.4; PA0 25.4,-20.32; PA1 25.4,-17.78; PA2 25.4,-15.24; PA3 25.4,-12.7; PA4 25.4,-10.16; PA5 25.4,-7.62; PA6 25.4,-5.08; PA7 25.4,-2.54; PB0 0,-2.54; PB1 0,-5.08; PB10 0,-7.62; PB11 0,-10.16; PB12 0,-12.7; PB13 0,-15.24; PB14 0,-17.78; PB15 0,-20.32; VCC 25.4,-22.86
53398-02 = smd 0.8 x 1.8: 1 0.625,-2.5; 2 -0.625,-2.5 | smd 2.1 x 3: S1 3.125,0.625; S2 -3.125,0.625
53398-08 = smd 0.8 x 1.8: 1 4.375,-2.5; 2 3.125,-2.5; 3 1.875,-2.5; 4 0.625,-2.5; 5 -0.625,-2.5; 6 -1.875,-2.5; 7 -3.125,-2.5; 8 -4.375,-2.5 | smd 2.1 x 3: S1 6.875,0.625; S2 -6.875,0.625
DO214AA = smd 1.8 x 2.2: A 2.55,0; C -2.55,0
3,2 = hole 3.2: 0,0
SOT23-5L = smd 0.55 x 1.2: 1 -0.95,-1.3; 2 0,-1.3; 3 0.95,-1.3; 4 0.95,1.3; 5 -0.95,1.3
SO08 = smd 0.61 x 2.21: 1 -1.905,-2.54; 2 -0.635,-2.54; 3 0.635,-2.54; 4 1.905,-2.54; 5 1.905,2.54; 6 0.635,2.54; 7 -0.635,2.54; 8 -1.905,2.54
PG-DSO-20 = smd 0.6 x 1.8: 1 -5.715,-4.6; 2 -4.445,-4.6; 3 -3.175,-4.6; 4 -1.905,-4.6; 5 -0.635,-4.6; 6 0.635,-4.6; 7 1.905,-4.6; 8 3.175,-4.6; 9 4.445,-4.6; 10 5.715,-4.6; 11 5.715,4.6; 12 4.445,4.6; 13 3.175,4.6; 14 1.905,4.6; 15 0.635,4.6; 16 -0.635,4.6; 17 -1.905,4.6; 18 -3.175,4.6; 19 -4.445,4.6; 20 -5.715,4.6
INF-PG-DSO-14-22_N_1PRIMARY = smd 1.55 x 0.6: 1 -2.65,3.81; 2 -2.65,2.54; 3 -2.65,1.27; 4 -2.65,0; 5 -2.65,-1.27; 6 -2.65,-2.54; 7 -2.65,-3.81; 8 2.65,-3.81; 9 2.65,-2.54; 10 2.65,-1.27; 11 2.65,0; 12 2.65,1.27; 13 2.65,2.54; 14 2.65,3.81
CHIP-LED0805 = smd 1.2 x 1.2: A 0,-1.05; C 0,1.05
SOT23 = smd 1 x 1.4: 1 -0.95,-1.1; 2 0.95,-1.1; 3 0,1.1
R0805 = smd 1.168 x 1.397: 1 -1.016,0; 2 1.016,0
R0603 = smd 1 x 1.1: 1 -0.85,0; 2 0.85,0
SJ = smd 1.168 x 1.6: 1 -0.762,0; 2 0.762,0
MAX16956_STEPDOWN6 = drill 1: GND 14.351,1.651; GND2 11.811,9.271; VIN 1.651,9.271; VOUT 1.651,1.651
MCV1,5/2-GF-3,5 = drill 1.3 long: 1 0,3.5; 2 0,0 | hole 2.4: 0,7.8; 0,-4.3
CIOC_4-1-FV = drill 1: 1 0,0; 2 2,0; 3 4,0; 4 6,0; 5 -4,0; 6 8,0
53398-04 = smd 0.8 x 1.8: 1 1.875,-2.5; 2 0.625,-2.5; 3 -0.625,-2.5; 4 -1.875,-2.5 | smd 2.1 x 3: S1 4.375,0.625; S2 -4.375,0.625
B3B-XH = drill 0.9 pad 1.422 square: P$1 0,0 | drill 0.9 pad 1.422: P$2 2.5,0; P$3 5,0
B2B-XH = drill 0.9 pad 1.422 square: P$1 0,0 | drill 0.9 pad 1.422: P$2 2.5,0
B4B-XH = drill 0.9 pad 1.422 square: P$1 0,0 | drill 0.9 pad 1.422: P$2 2.5,0; P$3 5,0; P$4 7.5,0
SM2T3V3A = smd 1.82 x 2.03: P$1 -1.21,0 | smd 1.38 x 0.75: P$2 1.1,0 | smd 0.5 x 1.1: P$11 -2.37,0.005

### Placement (x,y rotation side)
C1  22.74,7.47 180 bottom
C2  16.01,7.47 180 bottom
C3  9.28,7.47 180 bottom
C4  22.74,13.57 0 bottom
C5  16.01,13.57 0 bottom
C6  9.28,13.57 0 bottom
C7  28.97,25.63 90 bottom
C8  25.16,25.63 90 bottom
C9  21.35,25.63 90 bottom
C10  50.56,33.25 180 top
C11  42.3,40.24 270 bottom
C12  42.68,36.17 270 bottom
C13  51.7,38.46 180 bottom
CANIO_1  8.52,44.43 0 top
CON1  37.87,41.47 90 top
CON2  44.35,41.47 90 top
CON3  2.55,31.6 90 top
D1  40.54,8.45 90 bottom
H1  3,3 0 top
H2  52,3 0 top
H3  3,43 0 top
H4  52,43 0 top
IC1  22.74,10.64 0 bottom
IC2  16.01,10.52 0 bottom
IC3  9.28,10.52 0 bottom
IC4  51.45,33.76 0 bottom
IC5  16.39,38.71 180 bottom
IC6  46.11,25.12 0 bottom
LED1  39.13,14.33 0 top
LED2  29.47,16.74 270 top
LED3  46.11,35.54 0 top
Q1  25.54,41.76 270 bottom
Q2  14.62,32.74 0 top
Q3  14.49,28.55 0 top
R1  40.78,14.33 90 top
R2  33.03,16.74 180 top
R3  47.76,35.54 90 top
R4  28.97,19.41 90 bottom
R5  25.16,19.41 90 bottom
R6  21.35,19.41 90 bottom
R7  44.08,40.24 270 bottom
R8  39.13,40.24 90 bottom
R9  40.9,36.17 270 bottom
R10  39.13,36.17 90 bottom
R11  10.55,38.46 270 top
R12  36.46,22.58 270 bottom
R13  25.54,39.09 180 bottom
R14  29.47,42.65 180 bottom
R15  29.47,40.74 180 bottom
R16  17.41,30.71 270 top
R17  18.04,28.43 0 top
R18  10.68,30.71 270 top
R19  11.19,26.9 180 top
R20  11.19,28.43 0 top
R21  11.19,25.38 180 top
SJ1  12.46,4.8 0 bottom
SJ2  22.62,4.55 180 bottom
TB1  46.75,17.76 90 top
TB2  27.06,16.11 270 top
X1  44.62,6.98 0 top
X2  3.35,13.45 90 top
X3  23.5,11.53 90 top
X4  16.65,11.53 90 top
X5  9.92,11.53 90 top
X6  8.65,2.39 0 top
X7  18.81,2.39 0 top
X8  51.57,14.46 270 top
X9  51.57,27.79 270 top
ZD1  42.18,19.41 180 bottom
ZD2  30.87,23.47 90 bottom
ZD3  27.06,23.47 90 bottom
ZD4  23.25,23.47 90 bottom
ZD5  36.97,40.36 270 bottom
ZD6  36.84,35.54 270 bottom

### Tracks (layer width: path | path; a pad name or v marks a point on that pad's centre or on a via)
+3V3  (via drill 0.3)
  Top 0.254: LED3.A v46.11,34.27 | R17.2 18.81,28.43 v17.41,29.82 R16.2 18.3,30.75 18.3,35.28 15.97,37.61 R11.2
  Bottom 0.254: R12.2 CANIO_1.VCC
  Bottom 0.813: ZD1.P$2 TB1.VOUT
  other vias: 26.55,39.09
  pour Route15 (no thermals): 34.52,45.54 34.52,36.04 36.02,34.54 47.02,34.54 48.02,33.54 48.02,18.04 47.02,17.04 42.52,17.04 41.52,18.04 41.52,20.54 40.02,22.04 7.52,22.04 6.52,23.04 6.52,30.04 7.52,31.04 22.52,31.04 24.02,32.54 24.02,45.54
+5V  (via drill 0.3)
  Top 0.254: X4.4 v20.2,9.66 | X5.4 v13.35,9.66 | X3.4 v26.68,9.66 | TB2.VOUT 28.71,16.74 LED2.A 27.03,18.14 22.62,18.14 21.47,19.28 21.47,27.54 18.93,30.08 18.93,37.44 11.95,44.43 CANIO_1.+5V
  Bottom 0.254: C3.1 IC3.3 v8.33,10.64 IC3.4 | C2.1 IC2.3 v15.06,10.64 IC2.4 | C1.1 IC1.3 v21.79,10.64 IC1.4
  pour Route15 (no thermals): 30.52,20.04 30.52,9.54 29.52,8.54 7.52,8.54 6.52,9.54 6.52,20.04 7.52,21.04 29.52,21.04
CAN1_H
  Bottom 0.254: CANIO_1.CANH 7.46,21.57 X2.3
CAN1_L
  Bottom 0.254: CANIO_1.CANL 6.92,19.03 X2.2
CH_DI3_EX  (via drill 0.3)
  Top 0.254: CON3.3 v6.74,33.48
  Bottom 0.254: v6.74,33.48 7.22,33 9.54,33 9.92,32.62 14.11,32.62 14.49,33 IC5.17
CH_DI4_EX  (via drill 0.3)
  Top 0.254: CON3.4 v6.74,32.23
  Bottom 0.254: v6.74,32.23 7.12,31.84 7.12,30.71 7.38,30.46 17.41,30.46 18.3,31.35 IC5.14
CH_DO2_EX
  Top 0.254: CON3.6 6.33,29.73 6.87,29.19 6.87,28.55 7.63,27.79 9.45,27.79 R19.2 R21.2
CH_FLT_EX
  Top 0.254: CON3.5 6.6,30.98 7.12,30.46 9.15,30.46 9.75,29.86 R18.2 10.68,29.78 R20.2
CH_NDI3
  Bottom 0.254: CANIO_1.PB13 17.79,29.19 18.93,30.33 18.93,35.54 15.76,38.71 IC5.5
CH_NDI4
  Bottom 0.254: CANIO_1.PB14 16.14,26.65 20.2,30.71 20.2,35.54 18.3,37.44 IC5.7
CH_NDO2
  Top 0.254: R17.1 15.97,29.65 Q3.3 12.63,29.65 11.57,30.71 9.54,30.71 CANIO_1.PB12
CH_NFLT
  Top 0.254: CANIO_1.PB11 8.94,33.84 Q2.3 16.82,33.84 17.41,33.25 R16.1
CH_PON
  Bottom 0.254: IC5.3 13.22,41.25 12.46,40.49 7.38,40.49 7,40.11 7,37.19 7.38,36.81 CANIO_1.PB10
CH_PON_EX  (via drill 0.3)
  Top 0.254: CON3.2 v6.74,34.73
  Bottom 0.254: v6.74,34.73 7.68,35.66 12.84,35.66 13.22,35.28 IC5.18
CONVERTER_ON
  Bottom 0.254: CANIO_1.PB15 14.49,24.11 21.47,31.09 21.47,35.54 20.84,36.17 IC5.9
GND  (via drill 0.3)
  Top 0.254: X5.1 v11.95,13.41 | v25.41,13.41 X3.1 | C10.2 v49.54,33.25 49.54,34.27 49.29,34.52 R3.1 | R2.1 33.92,16.74 CANIO_1.GND1 | R1.1 40.78,11.91 v41.16,11.53 | v15.38,27.38 Q3.2 | R21.1 v12.08,25.35 | v10.3,28.52 10.3,28.46 R20.1 | CON3.1 v6.74,35.98
  Top 0.406: X4.1 v18.81,13.41
  Bottom 0.254: ZD4.P$1 23.25,21.23 ZD4.P$11 v23.26,21.19 v23.25,21.19 | v27.06,21.19 v27.07,21.19 ZD3.P$11 27.06,21.23 ZD3.P$1 | ZD2.P$1 30.87,21.23 ZD2.P$11 v30.88,21.19 v30.87,21.19 | C7.2 C8.2 | C8.2 v25.16,26.52 | C9.2 C8.2 | C6.2 v8.01,13.57 | C5.2 v14.74,13.57 | C4.2 v21.47,13.57 | C3.2 10.23,7.54 9.28,8.49 v9.28,8.99 | IC3.2 v9.28,8.99 | 9.28,8.61 v9.28,8.99 | C2.2 16.9,7.47 16.9,7.6 16.01,8.49 v16.01,8.99 IC2.2 | IC1.2 v22.74,9.12 22.74,8.49 23.69,7.54 C1.2 | D1.A 40.68,11 v41.16,10.52 | R10.2 37.28,37.19 ZD6.P$1 | ZD6.P$11 ZD6.P$1 | ZD5.P$11 v36.96,41.77 v36.97,41.76 ZD5.P$1 36.97,41.25 R8.2 | v36.84,36.55 ZD6.P$1 | ZD1.P$11 v40.9,19.41 v40.91,19.41 ZD1.P$1 | IC6.12 v43.44,26.39 | v43.44,25.12 IC6.11 | v43.44,23.85 IC6.10 | v48.78,26.39 IC6.3 | IC4.4 v49.54,33.25 | C13.2 52.65,38.52 v52.72,38.58 | Q1.2 28.39,40.81 R15.1 28.59,40.74 | IC6.5 v48.78,23.85 | IC6.4 v48.78,25.12 | IC5.2 v11.95,42.52 | IC5.6 v17.03,42.52
  other vias: 39.89,11.53 39.89,10.52 28.46,40.74 15.57,31.64
  pour Route2 (no thermals): 0.52,0.54 0.52,45.54 54.52,45.54 54.52,0.54
ILK1  (via drill 0.3)
  Top 0.254: CON3.8 5.05,6.62 7,4.68 v10.17,4.68
  Bottom 0.254: X7.P$3 23.81,4.12 SJ2.2 23.38,5.69 22.87,6.2 11.95,6.2 11.69,5.95 SJ1.2 11.57,4.68 v10.17,4.68
ILK1_CH  (via drill 0.3)
  Top 0.254: CON3.7 6.18,28.48 6.36,28.3 6.36,26.77 5.6,26.01 5.6,6.84 6.87,5.57 12.2,5.57 v12.96,4.8
  Bottom 0.254: X6.P$3 13.65,4.38 SJ1.1 v12.96,4.8
ILK2
  Bottom 0.254: SJ2.1 21.31,4 X7.P$2 19.78,0.87 12.67,0.87 X6.P$2
LEM_1  (via drill 0.3)
  Top 0.254: CANIO_1.PA1 30.36,26.65 27.32,23.6 24.22,23.6 ZD4.P$2
  Bottom 0.254: 21.35,24.7 C9.1 | C9.1 R6.2 | ZD4.P$2 21.46,24.57 C9.1
  other vias: 23.25,24.57
LEM_2  (via drill 0.3)
  Top 0.254: CANIO_1.PA2 31.68,29.19 ZD3.P$2
  Bottom 0.254: 25.16,24.7 C8.1 25.27,24.57 | ZD3.P$2 25.27,24.57 | 25.27,24.57 25.27,20.53 R5.2
  other vias: 27.06,24.57
LEM_3
  Bottom 0.254: 28.97,24.7 C7.1 | C7.1 R4.2 | C7.1 29.07,24.57 ZD2.P$2 30.87,28.68 CANIO_1.PA3
LK_1  (via drill 0.3)
  Top 0.254: CANIO_1.PA6 35.19,38.08 35.19,36.43 36.2,35.41 39.38,35.41 40.27,34.52 40.27,24.36 v42.05,22.58
  Bottom 0.254: v42.05,22.58 IC6.9
LK_2  (via drill 0.3)
  Top 0.254: CANIO_1.PA7 35.44,41.89 37.09,40.24 39,40.24 39.51,39.73 39.51,36.68 40.9,35.28 40.9,30.2 v47.13,23.98
  Bottom 0.254: v47.13,23.98 47.13,23.09 47.63,22.58 IC6.6
LK_EF
  Bottom 0.254: CANIO_1.PA0 35.95,24.11 R12.1 38.74,21.31 IC6.8
LK_RM
  Bottom 0.254: CANIO_1.PB0 9.92,43.28 9.92,44.43 10.81,45.32 23.12,45.32 24.44,44 Q1.3 24.44,39.18 R13.1
N$1
  Top 0.254: LED2.C R2.2
N$2
  Top 0.254: LED3.C 46.15,36.55 R3.2
N$3  (via drill 0.3)
  Top 0.61: v19.57,33 37.48,33 38.87,31.6 38.87,23.34 50.26,11.96 X8.P$2
  Bottom 0.61: v19.57,33 IC5.13
N$4  (via drill 0.3)
  Top 0.254: v24.52,10.91 X3.3
  Bottom 0.254: C4.1 IC1.5 23.69,11.09 23.88,10.91 v24.52,10.91
N$5
  Top 0.254: R1.2 39.16,15.34 LED1.C
N$7  (via drill 0.3)
  Top 0.254: v13.35,12.16 X5.2
  Bottom 0.254: v13.35,12.16 13.35,15.22 14.23,16.11 20.58,16.11 21.35,16.87 R6.1
N$9  (via drill 0.3)
  Top 0.254: v17.66,10.91 X4.3
  Bottom 0.254: C5.1 IC2.5 16.96,11.09 17.14,10.91 v17.66,10.91
N$16
  Top 0.254: Q3.1 13.54,26.9 R19.1
N$25  (via drill 0.3)
  Top 0.254: CON1.1 41.59,42.09 41.92,41.76 41.92,39.98 41.29,39.35 v41.29,37.57
  Bottom 0.254: v41.29,37.57 R9.1
N$31  (via drill 0.3)
  Top 0.254: X4.2 v20.08,12.16
  Bottom 0.254: v20.08,12.16 20.08,14.33 21.35,15.6 23.38,15.6 25.16,17.38 R5.1 25.28,18.27
N$32  (via drill 0.3)
  Top 0.254: v10.93,10.91 X5.3
  Bottom 0.254: C6.1 IC3.5 10.23,11.09 10.41,10.91 v10.93,10.91
N$33  (via drill 0.3)
  Top 0.254: X3.2 v26.81,12.16
  Bottom 0.254: v26.81,12.16 27.44,12.79 27.44,16.11 28.97,17.63 R4.1
N$35  (via drill 0.3)
  Top 0.254: v45.35,42.27 46.67,42.27 CON2.1
  Bottom 0.254: R7.1 44.08,42.01 44.33,42.27 v45.35,42.27
N$38
  Bottom 0.254: Q1.1 28.4,42.71 R14.1
N$39
  Bottom 0.254: R14.2 R15.2 30.49,35.28 32.65,33.12 41.67,33.12 45.09,29.7 51.95,29.7 53.1,28.55 53.1,24.31 X9.P$3
N$41
  Bottom 0.254: IC6.13 47,27.66 47.63,27.03 49.83,27.03 X9.P$2
N$42
  Bottom 0.254: IC6.2 51.45,27.66 X9.P$1
N$45
  Top 0.254: Q2.1 10.76,31.64 R18.1
Q_NFLT
  Top 0.254: CANIO_1.PB1 10.51,39.35 R11.1
  Bottom 0.254: CANIO_1.PB1 13.6,39.35 14.49,40.24 IC5.4 14.49,44.55 14.74,44.81 19.31,44.81 19.57,44.55 IC5.8
TS1
  Bottom 0.254: C12.2 40.97,35.22 R9.2 R10.1 38.11,35.16 37.39,34.44 ZD6.P$2 34.09,34.44 CANIO_1.PA4
TS2
  Bottom 0.254: CANIO_1.PA5 36.38,39.26 ZD5.P$2 37.01,39.22 R8.1 42.3,39.22 C11.2 44.08,39.29 R7.2
VBAT  (via drill 0.3)
  Top 0.254: C10.1 v51.57,33.25 | LED1.A 37.51,13.28 TB2.VIN
  Bottom 0.254: D1.C 40.7,5.9 v41.16,5.44 | IC6.7 v48.78,21.31 | IC6.1 v48.78,28.93 | IC4.2 52.08,32.74 v51.57,33.25 | IC5.1 v10.68,42.52 | IC5.10 v22.11,42.52 | IC5.11 v22.11,34.9 | IC5.12 v20.84,34.9 | IC5.15 v17.03,34.9 | IC5.16 v15.76,34.9 | IC5.19 v11.95,34.78 | IC5.20 v10.68,34.78
  other vias: 41.16,6.45 39.89,6.45 39.89,5.44
  pour Route15 (no thermals): 54.52,34.54 54.52,0.54 0.52,0.54 0.52,45.54 23.02,45.54 23.02,33.04 22.02,32.04 6.52,32.04 5.52,31.04 5.02,9.04 6.52,7.54 30.02,7.54 31.52,9.04 31.52,20.04 32.52,21.04 39.52,21.04 40.52,20.04 40.52,17.54 42.02,16.04 47.52,16.04 49.02,17.54 49.02,33.54 50.02,34.54
VREF_PTC_CH  (via drill 0.3)
  Top 0.254: v45.35,40.84 CON2.2 | CON1.2 v40.78,40.84
  Bottom 0.254: IC4.6 50.81,38.4 C13.1 50.75,38.65 v50.81,38.71 | C12.1 v42.68,36.68 | C11.1 42.3,40.84 v40.78,40.84
  pour Route15 (no thermals): 35.52,45.54 35.52,36.54 36.52,35.54 54.52,35.54 54.52,45.54

### Text on the board
Bottom: bottom | 12V system & / charter / controller / V2.0
tTest: 12V system- & / charger / controller | TS1 | TS2 | TERA TU Graz, / April 2015 / Pöschl | Charger | Lock | CAN | 3V3 | LEM 3 | LEM 1 | LEM 2 | DC/DC ON | 5V | IL-Out | IL-In | 12V
bTest: Charger / bypass | bypass next